# Altium schematic sheet Monitoring System_V1.0.SchDoc
size A; SheetNumber: 1; SheetTotal: 6
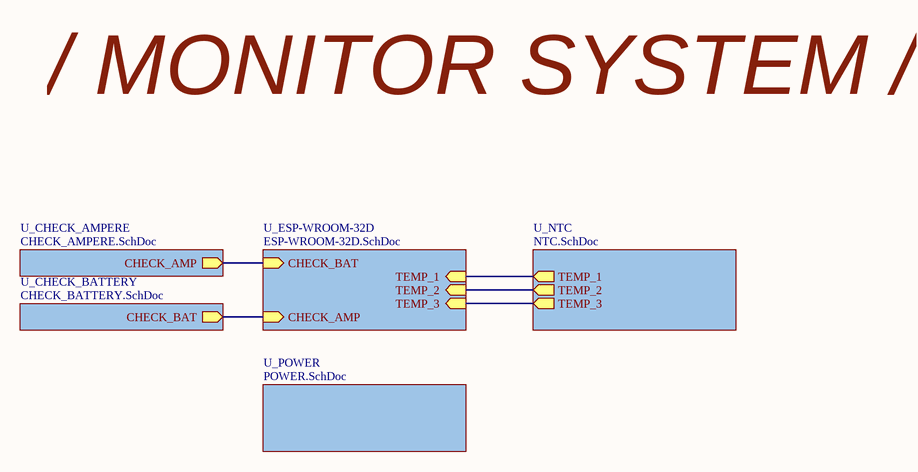
[diagram p0: Monitoring System_V1.0.SchDoc]

## Sub-sheets
U_CHECK_AMPERE = CHECK_AMPERE.SchDoc: CHECK_AMP (out)
U_CHECK_BATTERY = CHECK_BATTERY.SchDoc: CHECK_BAT (out)
U_ESP-WROOM-32D = ESP-WROOM-32D.SchDoc: CHECK_BAT (in), CHECK_AMP (in), TEMP_1 (in), TEMP_2 (in), TEMP_3 (in)
U_NTC = NTC.SchDoc: TEMP_1 (out), TEMP_2 (out), TEMP_3 (out)
U_POWER = POWER.SchDoc: no entries

## Nets
(unnamed): sheet U_CHECK_AMPERE/CHECK_AMP, sheet U_ESP-WROOM-32D/CHECK_BAT
(unnamed): sheet U_CHECK_BATTERY/CHECK_BAT, sheet U_ESP-WROOM-32D/CHECK_AMP
(unnamed): sheet U_ESP-WROOM-32D/TEMP_1, sheet U_NTC/TEMP_1
(unnamed): sheet U_ESP-WROOM-32D/TEMP_2, sheet U_NTC/TEMP_2
(unnamed): sheet U_ESP-WROOM-32D/TEMP_3, sheet U_NTC/TEMP_3

## Notes on the sheet
- / MONITOR SYSTEM /